# Altium schematic sheet ActuatorMKII_ParentSheet.SchDoc: Sample Sheet Title
size B; Date: MM/DD/YYYY; Author: Sample Author; Organization: ORGANIZATION; Address1: ADDRESS 1; Address2: ADDRESS 2; Address3: ADDRESS 3; Address4: ADDRESS 4; Revision: -; SheetNumber: 1; SheetTotal: 7; ENG_APP_DATE: --/--/--; DSN_APP_DATE: --/--/--; CHK_APP_DATE: --/--/--
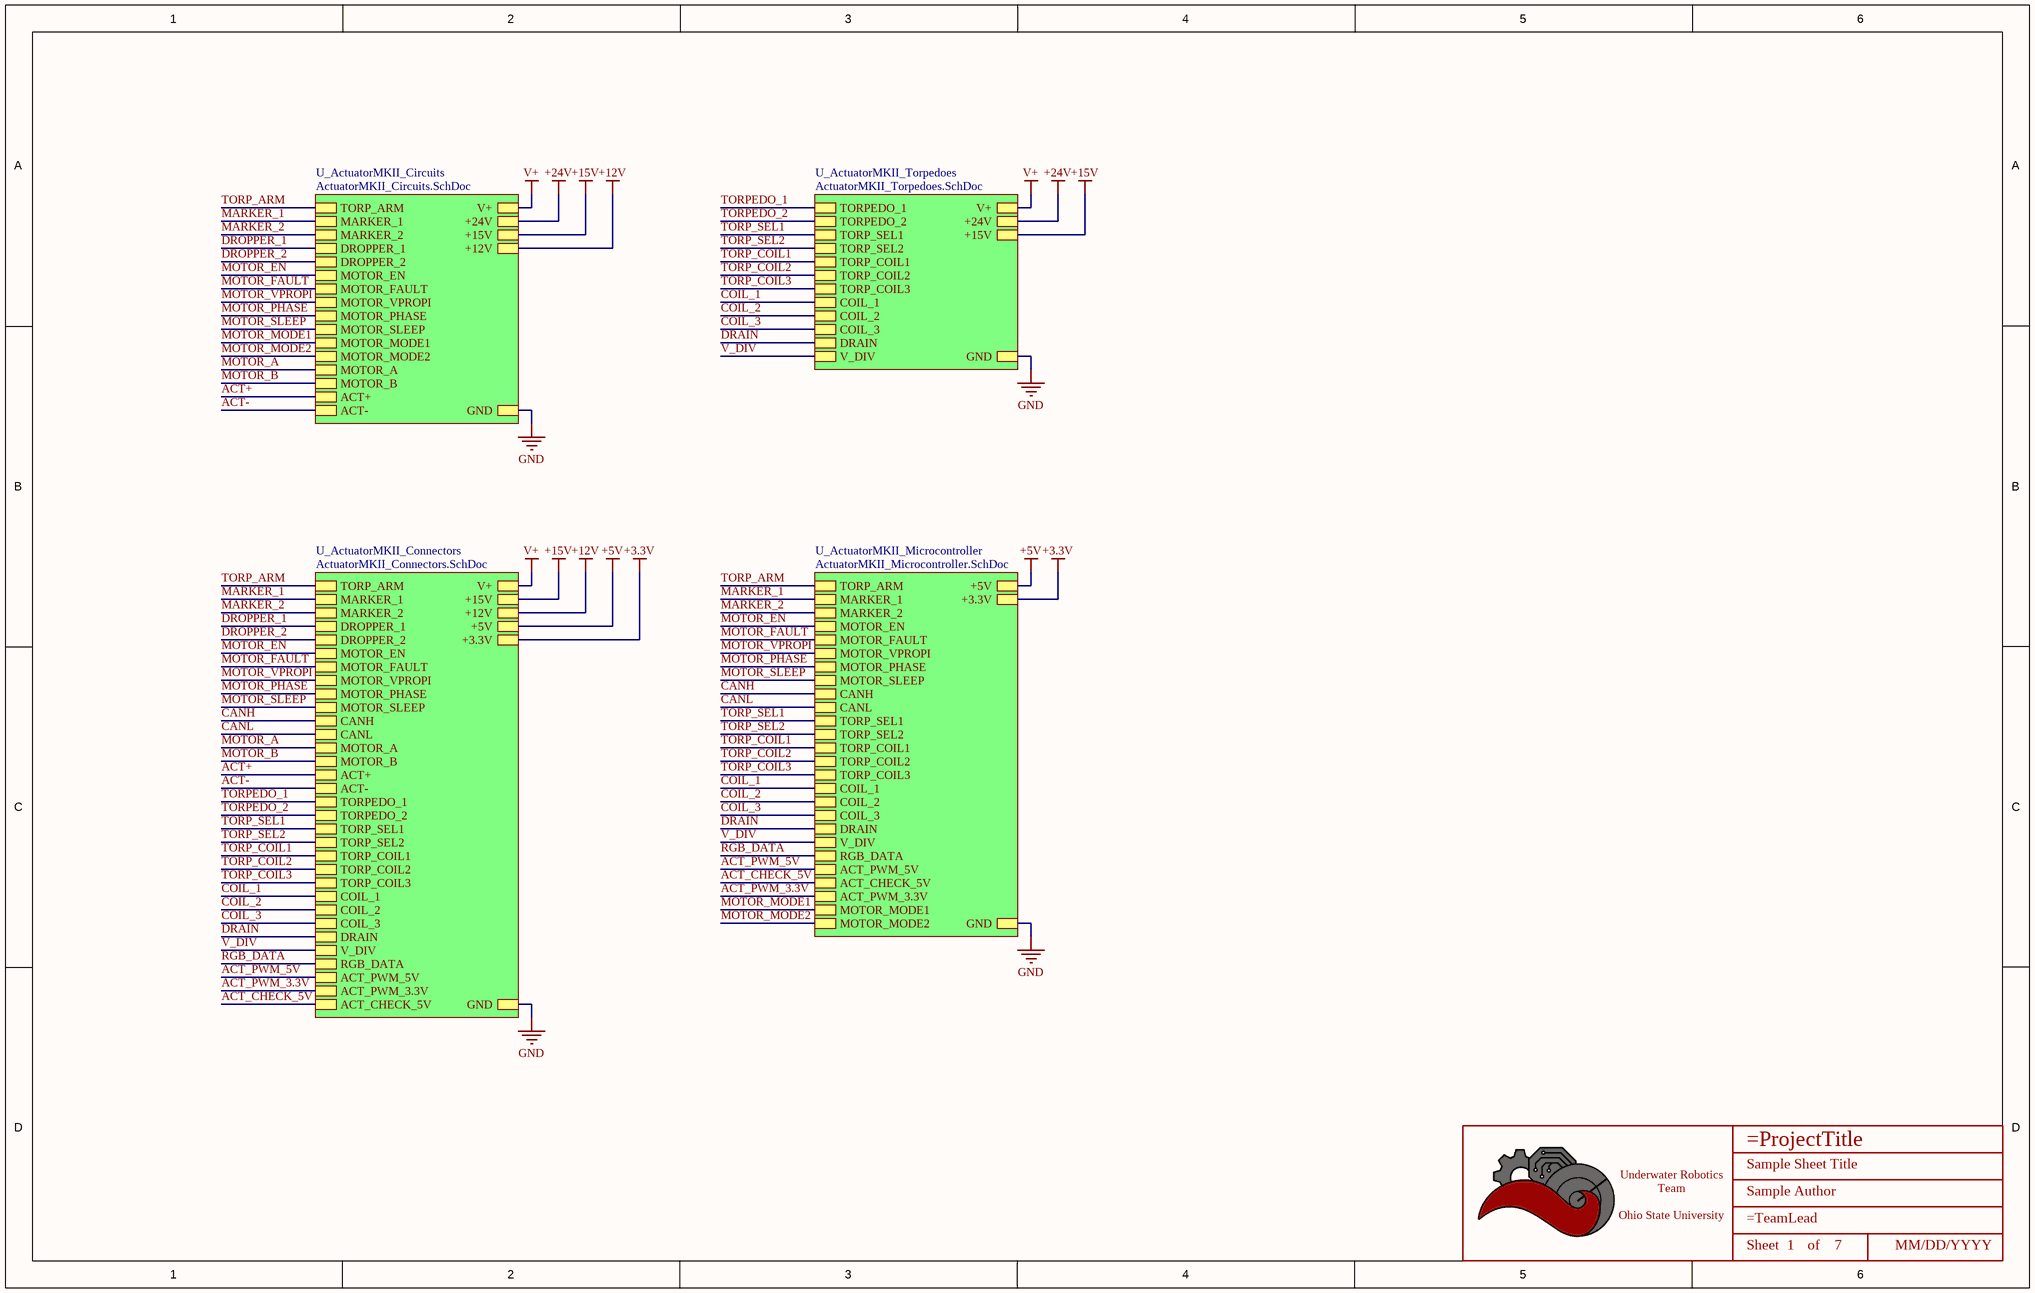
[diagram p0: ActuatorMKII_ParentSheet.SchDoc]

## Parts
*  Title_Block  [LOGO]  (value not drawn)  (graphical)

## Sub-sheets
U_ActuatorMKII_Circuits = ActuatorMKII_Circuits.SchDoc: V+, +15V, +12V, +24V, GND, TORP_ARM, MARKER_1, MARKER_2, DROPPER_1, DROPPER_2, MOTOR_EN, MOTOR_FAULT, MOTOR_VPROPI, MOTOR_PHASE, MOTOR_SLEEP, MOTOR_MODE1, MOTOR_MODE2, MOTOR_A, MOTOR_B, ACT+, ACT-
U_ActuatorMKII_Connectors = ActuatorMKII_Connectors.SchDoc: V+, +15V, +12V, GND, TORP_ARM, MARKER_1, MARKER_2, DROPPER_1, DROPPER_2, MOTOR_EN, MOTOR_FAULT, MOTOR_VPROPI, MOTOR_PHASE, MOTOR_SLEEP, CANH, CANL, MOTOR_A, MOTOR_B, ACT+, ACT-, +5V, +3.3V, TORPEDO_1, TORPEDO_2, TORP_SEL1, TORP_SEL2, TORP_COIL1, TORP_COIL2, TORP_COIL3, COIL_1, COIL_2, COIL_3, DRAIN, V_DIV, RGB_DATA, ACT_PWM_5V, ACT_CHECK_5V, ACT_PWM_3.3V
U_ActuatorMKII_Microcontroller = ActuatorMKII_Microcontroller.SchDoc: GND, +5V, +3.3V, TORP_ARM, MARKER_1, MARKER_2, MOTOR_EN, MOTOR_FAULT, MOTOR_VPROPI, MOTOR_PHASE, MOTOR_SLEEP, CANH, CANL, TORP_SEL1, TORP_SEL2, TORP_COIL1, TORP_COIL2, TORP_COIL3, COIL_1, COIL_2, COIL_3, DRAIN, V_DIV, RGB_DATA, ACT_PWM_5V, ACT_CHECK_5V, ACT_PWM_3.3V, MOTOR_MODE1, MOTOR_MODE2
U_ActuatorMKII_Torpedoes = ActuatorMKII_Torpedoes.SchDoc: V+, +15V, +24V, GND, TORPEDO_1, TORPEDO_2, TORP_SEL1, TORP_SEL2, TORP_COIL1, TORP_COIL2, TORP_COIL3, COIL_1, COIL_2, COIL_3, DRAIN, V_DIV

## Nets
+3.3V: sheet U_ActuatorMKII_Connectors/+3.3V, sheet U_ActuatorMKII_Microcontroller/+3.3V
+5V: sheet U_ActuatorMKII_Connectors/+5V, sheet U_ActuatorMKII_Microcontroller/+5V
+12V: sheet U_ActuatorMKII_Circuits/+12V, sheet U_ActuatorMKII_Connectors/+12V
+15V: sheet U_ActuatorMKII_Circuits/+15V, sheet U_ActuatorMKII_Torpedoes/+15V, sheet U_ActuatorMKII_Connectors/+15V
+24V: sheet U_ActuatorMKII_Circuits/+24V, sheet U_ActuatorMKII_Torpedoes/+24V
GND: sheet U_ActuatorMKII_Circuits/GND, sheet U_ActuatorMKII_Torpedoes/GND, sheet U_ActuatorMKII_Connectors/GND, sheet U_ActuatorMKII_Microcontroller/GND
V+: sheet U_ActuatorMKII_Circuits/V+, sheet U_ActuatorMKII_Torpedoes/V+, sheet U_ActuatorMKII_Connectors/V+
ACT+: sheet U_ActuatorMKII_Circuits/ACT+, sheet U_ActuatorMKII_Connectors/ACT+
ACT-: sheet U_ActuatorMKII_Circuits/ACT-, sheet U_ActuatorMKII_Connectors/ACT-
ACT_CHECK_5V: sheet U_ActuatorMKII_Connectors/ACT_CHECK_5V, sheet U_ActuatorMKII_Microcontroller/ACT_CHECK_5V
ACT_PWM_3.3V: sheet U_ActuatorMKII_Connectors/ACT_PWM_3.3V, sheet U_ActuatorMKII_Microcontroller/ACT_PWM_3.3V
ACT_PWM_5V: sheet U_ActuatorMKII_Connectors/ACT_PWM_5V, sheet U_ActuatorMKII_Microcontroller/ACT_PWM_5V
CANH: sheet U_ActuatorMKII_Connectors/CANH, sheet U_ActuatorMKII_Microcontroller/CANH
CANL: sheet U_ActuatorMKII_Connectors/CANL, sheet U_ActuatorMKII_Microcontroller/CANL
COIL_1: sheet U_ActuatorMKII_Torpedoes/COIL_1, sheet U_ActuatorMKII_Connectors/COIL_1, sheet U_ActuatorMKII_Microcontroller/COIL_1
COIL_2: sheet U_ActuatorMKII_Torpedoes/COIL_2, sheet U_ActuatorMKII_Connectors/COIL_2, sheet U_ActuatorMKII_Microcontroller/COIL_2
COIL_3: sheet U_ActuatorMKII_Torpedoes/COIL_3, sheet U_ActuatorMKII_Connectors/COIL_3, sheet U_ActuatorMKII_Microcontroller/COIL_3
DRAIN: sheet U_ActuatorMKII_Torpedoes/DRAIN, sheet U_ActuatorMKII_Connectors/DRAIN, sheet U_ActuatorMKII_Microcontroller/DRAIN
DROPPER_1: sheet U_ActuatorMKII_Circuits/DROPPER_1, sheet U_ActuatorMKII_Connectors/DROPPER_1
DROPPER_2: sheet U_ActuatorMKII_Circuits/DROPPER_2, sheet U_ActuatorMKII_Connectors/DROPPER_2
MARKER_1: sheet U_ActuatorMKII_Circuits/MARKER_1, sheet U_ActuatorMKII_Connectors/MARKER_1, sheet U_ActuatorMKII_Microcontroller/MARKER_1
MARKER_2: sheet U_ActuatorMKII_Circuits/MARKER_2, sheet U_ActuatorMKII_Connectors/MARKER_2, sheet U_ActuatorMKII_Microcontroller/MARKER_2
MOTOR_A: sheet U_ActuatorMKII_Circuits/MOTOR_A, sheet U_ActuatorMKII_Connectors/MOTOR_A
MOTOR_B: sheet U_ActuatorMKII_Circuits/MOTOR_B, sheet U_ActuatorMKII_Connectors/MOTOR_B
MOTOR_EN: sheet U_ActuatorMKII_Circuits/MOTOR_EN, sheet U_ActuatorMKII_Connectors/MOTOR_EN, sheet U_ActuatorMKII_Microcontroller/MOTOR_EN
MOTOR_FAULT: sheet U_ActuatorMKII_Circuits/MOTOR_FAULT, sheet U_ActuatorMKII_Connectors/MOTOR_FAULT, sheet U_ActuatorMKII_Microcontroller/MOTOR_FAULT
MOTOR_MODE1: sheet U_ActuatorMKII_Circuits/MOTOR_MODE1, sheet U_ActuatorMKII_Microcontroller/MOTOR_MODE1
MOTOR_MODE2: sheet U_ActuatorMKII_Circuits/MOTOR_MODE2, sheet U_ActuatorMKII_Microcontroller/MOTOR_MODE2
MOTOR_PHASE: sheet U_ActuatorMKII_Circuits/MOTOR_PHASE, sheet U_ActuatorMKII_Connectors/MOTOR_PHASE, sheet U_ActuatorMKII_Microcontroller/MOTOR_PHASE
MOTOR_SLEEP: sheet U_ActuatorMKII_Circuits/MOTOR_SLEEP, sheet U_ActuatorMKII_Connectors/MOTOR_SLEEP, sheet U_ActuatorMKII_Microcontroller/MOTOR_SLEEP
MOTOR_VPROPI: sheet U_ActuatorMKII_Circuits/MOTOR_VPROPI, sheet U_ActuatorMKII_Connectors/MOTOR_VPROPI, sheet U_ActuatorMKII_Microcontroller/MOTOR_VPROPI
RGB_DATA: sheet U_ActuatorMKII_Connectors/RGB_DATA, sheet U_ActuatorMKII_Microcontroller/RGB_DATA
TORP_ARM: sheet U_ActuatorMKII_Circuits/TORP_ARM, sheet U_ActuatorMKII_Connectors/TORP_ARM, sheet U_ActuatorMKII_Microcontroller/TORP_ARM
TORP_COIL1: sheet U_ActuatorMKII_Torpedoes/TORP_COIL1, sheet U_ActuatorMKII_Connectors/TORP_COIL1, sheet U_ActuatorMKII_Microcontroller/TORP_COIL1
TORP_COIL2: sheet U_ActuatorMKII_Torpedoes/TORP_COIL2, sheet U_ActuatorMKII_Connectors/TORP_COIL2, sheet U_ActuatorMKII_Microcontroller/TORP_COIL2
TORP_COIL3: sheet U_ActuatorMKII_Torpedoes/TORP_COIL3, sheet U_ActuatorMKII_Connectors/TORP_COIL3, sheet U_ActuatorMKII_Microcontroller/TORP_COIL3
TORP_SEL1: sheet U_ActuatorMKII_Torpedoes/TORP_SEL1, sheet U_ActuatorMKII_Connectors/TORP_SEL1, sheet U_ActuatorMKII_Microcontroller/TORP_SEL1
TORP_SEL2: sheet U_ActuatorMKII_Torpedoes/TORP_SEL2, sheet U_ActuatorMKII_Connectors/TORP_SEL2, sheet U_ActuatorMKII_Microcontroller/TORP_SEL2
TORPEDO_1: sheet U_ActuatorMKII_Torpedoes/TORPEDO_1, sheet U_ActuatorMKII_Connectors/TORPEDO_1
TORPEDO_2: sheet U_ActuatorMKII_Torpedoes/TORPEDO_2, sheet U_ActuatorMKII_Connectors/TORPEDO_2
V_DIV: sheet U_ActuatorMKII_Torpedoes/V_DIV, sheet U_ActuatorMKII_Connectors/V_DIV, sheet U_ActuatorMKII_Microcontroller/V_DIV

## Notes on the sheet
- DWG. NO.
- REV.
- SHT.
- THIS DOCUMENT AND THE DATA DISCLOSED HEREIN OR HEREWITH IS THE PROPERTY OF ALTIUM LIMITED AND MAY BE FREELY DISTRIBUTED IN WHOLE. NO RIGHTS ARE RESERVED OR EXPRESS OR IMPLIED WARANTEE GIVEN.
- REVISION
- DESCRIPTION
- DATE
- APPROVED
- ENG:
- APPROVALS
- PROJECT
- DSN:
- CHK:
- REFERENCE DOCUMENTS
- PROJECT REVISION:
- TITLE
- DOCUMENT REVISION:
- DESIGN ITEM:
- BOM:
- FAB DWG:
- PCB DWG:
- ASSY DWG:
- SCALE:
- SIZE
- B
- CAGE CODE
- FILE NAME
- DWG NO.
- SHEET
- OF
- REV
- (in symbol Title_Block) Underwater Robotics Team / Ohio State University; Sheet; of

## Library data of the parts
* = Title_Block: UWRT Schematic Title Block Template / Created June 2021, Dylan Trainor